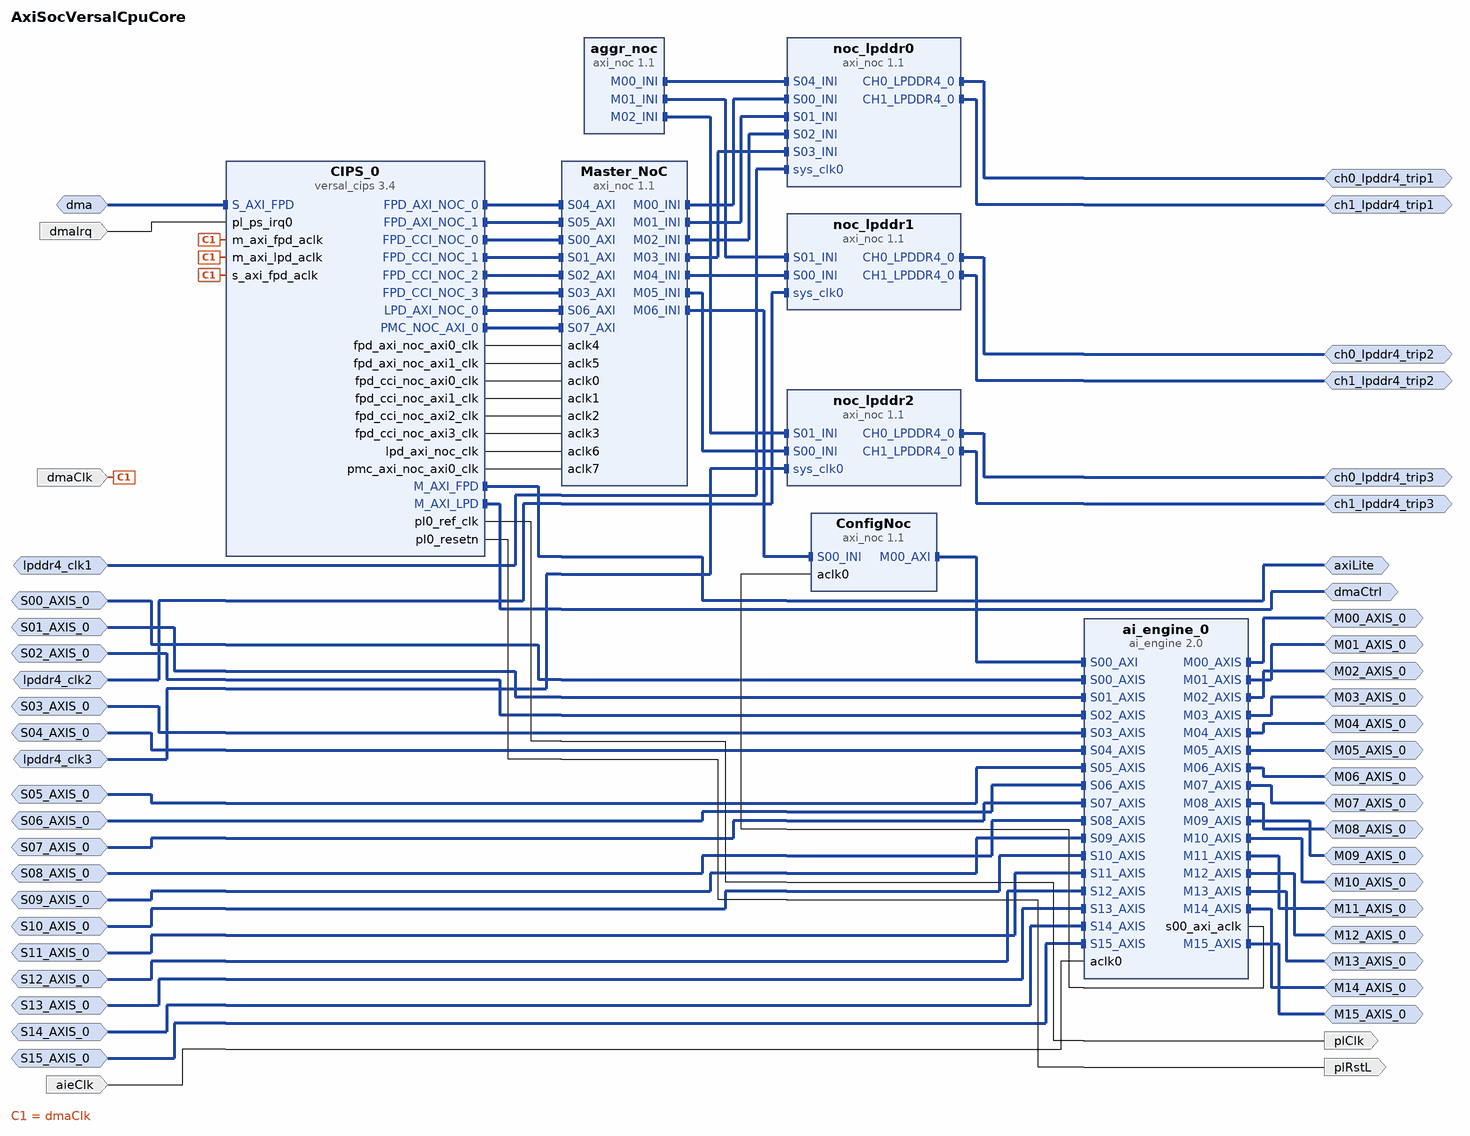
[diagram p0: block diagram of the top level]
# Vivado block design AxiSocVersalCpuCore, xcve2802-vsvh1760-2MP-e-S, Vivado 2025.1
create_bd_design AxiSocVersalCpuCore

create_bd_intf_port -mode Master -vlnv xilinx.com:interface:lpddr4_rtl:1.0 ch0_lpddr4_trip1
create_bd_intf_port -mode Master -vlnv xilinx.com:interface:lpddr4_rtl:1.0 ch1_lpddr4_trip1
create_bd_intf_port -mode Slave -vlnv xilinx.com:interface:diff_clock_rtl:1.0 lpddr4_clk1
set_property -dict {CONFIG.FREQ_HZ 200000000} [get_bd_intf_ports lpddr4_clk1]
create_bd_intf_port -mode Master -vlnv xilinx.com:interface:lpddr4_rtl:1.0 ch0_lpddr4_trip2
create_bd_intf_port -mode Master -vlnv xilinx.com:interface:lpddr4_rtl:1.0 ch1_lpddr4_trip2
create_bd_intf_port -mode Slave -vlnv xilinx.com:interface:diff_clock_rtl:1.0 lpddr4_clk2
set_property -dict {CONFIG.FREQ_HZ 200000000} [get_bd_intf_ports lpddr4_clk2]
create_bd_intf_port -mode Master -vlnv xilinx.com:interface:lpddr4_rtl:1.0 ch0_lpddr4_trip3
create_bd_intf_port -mode Master -vlnv xilinx.com:interface:lpddr4_rtl:1.0 ch1_lpddr4_trip3
create_bd_intf_port -mode Slave -vlnv xilinx.com:interface:diff_clock_rtl:1.0 lpddr4_clk3
set_property -dict {CONFIG.FREQ_HZ 200000000} [get_bd_intf_ports lpddr4_clk3]
create_bd_intf_port -mode Slave -vlnv xilinx.com:interface:aximm_rtl:1.0 dma
set_property -dict [list \
  CONFIG.ADDR_WIDTH 49 \
  CONFIG.ARUSER_WIDTH 10 \
  CONFIG.AWUSER_WIDTH 10 \
  CONFIG.BUSER_WIDTH 0 \
  CONFIG.DATA_WIDTH 128 \
  CONFIG.FREQ_HZ 250000000 \
  CONFIG.HAS_BRESP 1 \
  CONFIG.HAS_BURST 1 \
  CONFIG.HAS_CACHE 1 \
  CONFIG.HAS_LOCK 1 \
  CONFIG.HAS_PROT 1 \
  CONFIG.HAS_QOS 1 \
  CONFIG.HAS_REGION 0 \
  CONFIG.HAS_RRESP 1 \
  CONFIG.HAS_WSTRB 1 \
  CONFIG.ID_WIDTH 6 \
  CONFIG.MAX_BURST_LENGTH 256 \
  CONFIG.NUM_READ_OUTSTANDING 2 \
  CONFIG.NUM_READ_THREADS 1 \
  CONFIG.NUM_WRITE_OUTSTANDING 2 \
  CONFIG.NUM_WRITE_THREADS 1 \
  CONFIG.PROTOCOL AXI4 \
  CONFIG.READ_WRITE_MODE READ_WRITE \
  CONFIG.RUSER_BITS_PER_BYTE 0 \
  CONFIG.RUSER_WIDTH 0 \
  CONFIG.SUPPORTS_NARROW_BURST 1 \
  CONFIG.WUSER_BITS_PER_BYTE 0 \
  CONFIG.WUSER_WIDTH 0 \
] [get_bd_intf_ports dma]
create_bd_intf_port -mode Master -vlnv xilinx.com:interface:aximm_rtl:1.0 dmaCtrl
set_property -dict [list \
  CONFIG.ADDR_WIDTH 44 \
  CONFIG.DATA_WIDTH 32 \
  CONFIG.FREQ_HZ 250000000 \
  CONFIG.HAS_REGION 0 \
  CONFIG.NUM_READ_OUTSTANDING 2 \
  CONFIG.NUM_WRITE_OUTSTANDING 2 \
  CONFIG.PROTOCOL AXI4 \
] [get_bd_intf_ports dmaCtrl]
create_bd_intf_port -mode Master -vlnv xilinx.com:interface:aximm_rtl:1.0 axiLite
set_property -dict [list \
  CONFIG.ADDR_WIDTH 44 \
  CONFIG.DATA_WIDTH 32 \
  CONFIG.FREQ_HZ 250000000 \
  CONFIG.HAS_REGION 0 \
  CONFIG.NUM_READ_OUTSTANDING 2 \
  CONFIG.NUM_WRITE_OUTSTANDING 2 \
  CONFIG.PROTOCOL AXI4 \
] [get_bd_intf_ports axiLite]
create_bd_intf_port -mode Slave -vlnv xilinx.com:interface:axis_rtl:1.0 S00_AXIS_0
set_property -dict [list \
  CONFIG.FREQ_HZ 250000000 \
  CONFIG.HAS_TKEEP 1 \
  CONFIG.HAS_TLAST 1 \
  CONFIG.HAS_TREADY 1 \
  CONFIG.HAS_TSTRB 0 \
  CONFIG.LAYERED_METADATA undef \
  CONFIG.TDATA_NUM_BYTES 16 \
  CONFIG.TDEST_WIDTH 0 \
  CONFIG.TID_WIDTH 0 \
  CONFIG.TUSER_WIDTH 0 \
] [get_bd_intf_ports S00_AXIS_0]
create_bd_intf_port -mode Slave -vlnv xilinx.com:interface:axis_rtl:1.0 S01_AXIS_0
set_property -dict [list \
  CONFIG.FREQ_HZ 250000000 \
  CONFIG.HAS_TKEEP 1 \
  CONFIG.HAS_TLAST 1 \
  CONFIG.HAS_TREADY 1 \
  CONFIG.HAS_TSTRB 0 \
  CONFIG.LAYERED_METADATA undef \
  CONFIG.TDATA_NUM_BYTES 16 \
  CONFIG.TDEST_WIDTH 0 \
  CONFIG.TID_WIDTH 0 \
  CONFIG.TUSER_WIDTH 0 \
] [get_bd_intf_ports S01_AXIS_0]
create_bd_intf_port -mode Slave -vlnv xilinx.com:interface:axis_rtl:1.0 S02_AXIS_0
set_property -dict [list \
  CONFIG.FREQ_HZ 250000000 \
  CONFIG.HAS_TKEEP 1 \
  CONFIG.HAS_TLAST 1 \
  CONFIG.HAS_TREADY 1 \
  CONFIG.HAS_TSTRB 0 \
  CONFIG.LAYERED_METADATA undef \
  CONFIG.TDATA_NUM_BYTES 16 \
  CONFIG.TDEST_WIDTH 0 \
  CONFIG.TID_WIDTH 0 \
  CONFIG.TUSER_WIDTH 0 \
] [get_bd_intf_ports S02_AXIS_0]
create_bd_intf_port -mode Slave -vlnv xilinx.com:interface:axis_rtl:1.0 S03_AXIS_0
set_property -dict [list \
  CONFIG.FREQ_HZ 250000000 \
  CONFIG.HAS_TKEEP 1 \
  CONFIG.HAS_TLAST 1 \
  CONFIG.HAS_TREADY 1 \
  CONFIG.HAS_TSTRB 0 \
  CONFIG.LAYERED_METADATA undef \
  CONFIG.TDATA_NUM_BYTES 16 \
  CONFIG.TDEST_WIDTH 0 \
  CONFIG.TID_WIDTH 0 \
  CONFIG.TUSER_WIDTH 0 \
] [get_bd_intf_ports S03_AXIS_0]
create_bd_intf_port -mode Slave -vlnv xilinx.com:interface:axis_rtl:1.0 S04_AXIS_0
set_property -dict [list \
  CONFIG.FREQ_HZ 250000000 \
  CONFIG.HAS_TKEEP 1 \
  CONFIG.HAS_TLAST 1 \
  CONFIG.HAS_TREADY 1 \
  CONFIG.HAS_TSTRB 0 \
  CONFIG.LAYERED_METADATA undef \
  CONFIG.TDATA_NUM_BYTES 16 \
  CONFIG.TDEST_WIDTH 0 \
  CONFIG.TID_WIDTH 0 \
  CONFIG.TUSER_WIDTH 0 \
] [get_bd_intf_ports S04_AXIS_0]
create_bd_intf_port -mode Slave -vlnv xilinx.com:interface:axis_rtl:1.0 S05_AXIS_0
set_property -dict [list \
  CONFIG.FREQ_HZ 250000000 \
  CONFIG.HAS_TKEEP 1 \
  CONFIG.HAS_TLAST 1 \
  CONFIG.HAS_TREADY 1 \
  CONFIG.HAS_TSTRB 0 \
  CONFIG.LAYERED_METADATA undef \
  CONFIG.TDATA_NUM_BYTES 16 \
  CONFIG.TDEST_WIDTH 0 \
  CONFIG.TID_WIDTH 0 \
  CONFIG.TUSER_WIDTH 0 \
] [get_bd_intf_ports S05_AXIS_0]
create_bd_intf_port -mode Slave -vlnv xilinx.com:interface:axis_rtl:1.0 S06_AXIS_0
set_property -dict [list \
  CONFIG.FREQ_HZ 250000000 \
  CONFIG.HAS_TKEEP 1 \
  CONFIG.HAS_TLAST 1 \
  CONFIG.HAS_TREADY 1 \
  CONFIG.HAS_TSTRB 0 \
  CONFIG.LAYERED_METADATA undef \
  CONFIG.TDATA_NUM_BYTES 16 \
  CONFIG.TDEST_WIDTH 0 \
  CONFIG.TID_WIDTH 0 \
  CONFIG.TUSER_WIDTH 0 \
] [get_bd_intf_ports S06_AXIS_0]
create_bd_intf_port -mode Slave -vlnv xilinx.com:interface:axis_rtl:1.0 S07_AXIS_0
set_property -dict [list \
  CONFIG.FREQ_HZ 250000000 \
  CONFIG.HAS_TKEEP 1 \
  CONFIG.HAS_TLAST 1 \
  CONFIG.HAS_TREADY 1 \
  CONFIG.HAS_TSTRB 0 \
  CONFIG.LAYERED_METADATA undef \
  CONFIG.TDATA_NUM_BYTES 16 \
  CONFIG.TDEST_WIDTH 0 \
  CONFIG.TID_WIDTH 0 \
  CONFIG.TUSER_WIDTH 0 \
] [get_bd_intf_ports S07_AXIS_0]
create_bd_intf_port -mode Slave -vlnv xilinx.com:interface:axis_rtl:1.0 S08_AXIS_0
set_property -dict [list \
  CONFIG.FREQ_HZ 250000000 \
  CONFIG.HAS_TKEEP 1 \
  CONFIG.HAS_TLAST 1 \
  CONFIG.HAS_TREADY 1 \
  CONFIG.HAS_TSTRB 0 \
  CONFIG.LAYERED_METADATA undef \
  CONFIG.TDATA_NUM_BYTES 16 \
  CONFIG.TDEST_WIDTH 0 \
  CONFIG.TID_WIDTH 0 \
  CONFIG.TUSER_WIDTH 0 \
] [get_bd_intf_ports S08_AXIS_0]
create_bd_intf_port -mode Slave -vlnv xilinx.com:interface:axis_rtl:1.0 S09_AXIS_0
set_property -dict [list \
  CONFIG.FREQ_HZ 250000000 \
  CONFIG.HAS_TKEEP 1 \
  CONFIG.HAS_TLAST 1 \
  CONFIG.HAS_TREADY 1 \
  CONFIG.HAS_TSTRB 0 \
  CONFIG.LAYERED_METADATA undef \
  CONFIG.TDATA_NUM_BYTES 16 \
  CONFIG.TDEST_WIDTH 0 \
  CONFIG.TID_WIDTH 0 \
  CONFIG.TUSER_WIDTH 0 \
] [get_bd_intf_ports S09_AXIS_0]
create_bd_intf_port -mode Slave -vlnv xilinx.com:interface:axis_rtl:1.0 S10_AXIS_0
set_property -dict [list \
  CONFIG.FREQ_HZ 250000000 \
  CONFIG.HAS_TKEEP 1 \
  CONFIG.HAS_TLAST 1 \
  CONFIG.HAS_TREADY 1 \
  CONFIG.HAS_TSTRB 0 \
  CONFIG.LAYERED_METADATA undef \
  CONFIG.TDATA_NUM_BYTES 16 \
  CONFIG.TDEST_WIDTH 0 \
  CONFIG.TID_WIDTH 0 \
  CONFIG.TUSER_WIDTH 0 \
] [get_bd_intf_ports S10_AXIS_0]
create_bd_intf_port -mode Slave -vlnv xilinx.com:interface:axis_rtl:1.0 S11_AXIS_0
set_property -dict [list \
  CONFIG.FREQ_HZ 250000000 \
  CONFIG.HAS_TKEEP 1 \
  CONFIG.HAS_TLAST 1 \
  CONFIG.HAS_TREADY 1 \
  CONFIG.HAS_TSTRB 0 \
  CONFIG.LAYERED_METADATA undef \
  CONFIG.TDATA_NUM_BYTES 16 \
  CONFIG.TDEST_WIDTH 0 \
  CONFIG.TID_WIDTH 0 \
  CONFIG.TUSER_WIDTH 0 \
] [get_bd_intf_ports S11_AXIS_0]
create_bd_intf_port -mode Slave -vlnv xilinx.com:interface:axis_rtl:1.0 S12_AXIS_0
set_property -dict [list \
  CONFIG.FREQ_HZ 250000000 \
  CONFIG.HAS_TKEEP 1 \
  CONFIG.HAS_TLAST 1 \
  CONFIG.HAS_TREADY 1 \
  CONFIG.HAS_TSTRB 0 \
  CONFIG.LAYERED_METADATA undef \
  CONFIG.TDATA_NUM_BYTES 16 \
  CONFIG.TDEST_WIDTH 0 \
  CONFIG.TID_WIDTH 0 \
  CONFIG.TUSER_WIDTH 0 \
] [get_bd_intf_ports S12_AXIS_0]
create_bd_intf_port -mode Slave -vlnv xilinx.com:interface:axis_rtl:1.0 S13_AXIS_0
set_property -dict [list \
  CONFIG.FREQ_HZ 250000000 \
  CONFIG.HAS_TKEEP 1 \
  CONFIG.HAS_TLAST 1 \
  CONFIG.HAS_TREADY 1 \
  CONFIG.HAS_TSTRB 0 \
  CONFIG.LAYERED_METADATA undef \
  CONFIG.TDATA_NUM_BYTES 16 \
  CONFIG.TDEST_WIDTH 0 \
  CONFIG.TID_WIDTH 0 \
  CONFIG.TUSER_WIDTH 0 \
] [get_bd_intf_ports S13_AXIS_0]
create_bd_intf_port -mode Slave -vlnv xilinx.com:interface:axis_rtl:1.0 S14_AXIS_0
set_property -dict [list \
  CONFIG.FREQ_HZ 250000000 \
  CONFIG.HAS_TKEEP 1 \
  CONFIG.HAS_TLAST 1 \
  CONFIG.HAS_TREADY 1 \
  CONFIG.HAS_TSTRB 0 \
  CONFIG.LAYERED_METADATA undef \
  CONFIG.TDATA_NUM_BYTES 16 \
  CONFIG.TDEST_WIDTH 0 \
  CONFIG.TID_WIDTH 0 \
  CONFIG.TUSER_WIDTH 0 \
] [get_bd_intf_ports S14_AXIS_0]
create_bd_intf_port -mode Slave -vlnv xilinx.com:interface:axis_rtl:1.0 S15_AXIS_0
set_property -dict [list \
  CONFIG.FREQ_HZ 250000000 \
  CONFIG.HAS_TKEEP 1 \
  CONFIG.HAS_TLAST 1 \
  CONFIG.HAS_TREADY 1 \
  CONFIG.HAS_TSTRB 0 \
  CONFIG.LAYERED_METADATA undef \
  CONFIG.TDATA_NUM_BYTES 16 \
  CONFIG.TDEST_WIDTH 0 \
  CONFIG.TID_WIDTH 0 \
  CONFIG.TUSER_WIDTH 0 \
] [get_bd_intf_ports S15_AXIS_0]
create_bd_intf_port -mode Master -vlnv xilinx.com:interface:axis_rtl:1.0 M00_AXIS_0
set_property -dict {CONFIG.FREQ_HZ 250000000} [get_bd_intf_ports M00_AXIS_0]
create_bd_intf_port -mode Master -vlnv xilinx.com:interface:axis_rtl:1.0 M01_AXIS_0
set_property -dict {CONFIG.FREQ_HZ 250000000} [get_bd_intf_ports M01_AXIS_0]
create_bd_intf_port -mode Master -vlnv xilinx.com:interface:axis_rtl:1.0 M02_AXIS_0
set_property -dict {CONFIG.FREQ_HZ 250000000} [get_bd_intf_ports M02_AXIS_0]
create_bd_intf_port -mode Master -vlnv xilinx.com:interface:axis_rtl:1.0 M03_AXIS_0
set_property -dict {CONFIG.FREQ_HZ 250000000} [get_bd_intf_ports M03_AXIS_0]
create_bd_intf_port -mode Master -vlnv xilinx.com:interface:axis_rtl:1.0 M04_AXIS_0
set_property -dict {CONFIG.FREQ_HZ 250000000} [get_bd_intf_ports M04_AXIS_0]
create_bd_intf_port -mode Master -vlnv xilinx.com:interface:axis_rtl:1.0 M05_AXIS_0
set_property -dict {CONFIG.FREQ_HZ 250000000} [get_bd_intf_ports M05_AXIS_0]
create_bd_intf_port -mode Master -vlnv xilinx.com:interface:axis_rtl:1.0 M06_AXIS_0
set_property -dict {CONFIG.FREQ_HZ 250000000} [get_bd_intf_ports M06_AXIS_0]
create_bd_intf_port -mode Master -vlnv xilinx.com:interface:axis_rtl:1.0 M07_AXIS_0
set_property -dict {CONFIG.FREQ_HZ 250000000} [get_bd_intf_ports M07_AXIS_0]
create_bd_intf_port -mode Master -vlnv xilinx.com:interface:axis_rtl:1.0 M08_AXIS_0
set_property -dict {CONFIG.FREQ_HZ 250000000} [get_bd_intf_ports M08_AXIS_0]
create_bd_intf_port -mode Master -vlnv xilinx.com:interface:axis_rtl:1.0 M09_AXIS_0
set_property -dict {CONFIG.FREQ_HZ 250000000} [get_bd_intf_ports M09_AXIS_0]
create_bd_intf_port -mode Master -vlnv xilinx.com:interface:axis_rtl:1.0 M10_AXIS_0
set_property -dict {CONFIG.FREQ_HZ 250000000} [get_bd_intf_ports M10_AXIS_0]
create_bd_intf_port -mode Master -vlnv xilinx.com:interface:axis_rtl:1.0 M11_AXIS_0
set_property -dict {CONFIG.FREQ_HZ 250000000} [get_bd_intf_ports M11_AXIS_0]
create_bd_intf_port -mode Master -vlnv xilinx.com:interface:axis_rtl:1.0 M12_AXIS_0
set_property -dict {CONFIG.FREQ_HZ 250000000} [get_bd_intf_ports M12_AXIS_0]
create_bd_intf_port -mode Master -vlnv xilinx.com:interface:axis_rtl:1.0 M13_AXIS_0
set_property -dict {CONFIG.FREQ_HZ 250000000} [get_bd_intf_ports M13_AXIS_0]
create_bd_intf_port -mode Master -vlnv xilinx.com:interface:axis_rtl:1.0 M14_AXIS_0
set_property -dict {CONFIG.FREQ_HZ 250000000} [get_bd_intf_ports M14_AXIS_0]
create_bd_intf_port -mode Master -vlnv xilinx.com:interface:axis_rtl:1.0 M15_AXIS_0
set_property -dict {CONFIG.FREQ_HZ 250000000} [get_bd_intf_ports M15_AXIS_0]
create_bd_port -dir I -type intr dmaIrq
create_bd_port -dir I -type clk dmaClk
set_property -dict {CONFIG.ASSOCIATED_BUSIF dma:dmaCtrl:axiLite CONFIG.FREQ_HZ 250000000} [get_bd_ports dmaClk]
create_bd_port -dir O -type clk plClk
create_bd_port -dir O -type rst plRstL
create_bd_port -dir I -type clk aieClk
set_property -dict [list \
  CONFIG.ASSOCIATED_BUSIF M00_AXIS_0:M15_AXIS_0:M14_AXIS_0:M13_AXIS_0:M12_AXIS_0:M11_AXIS_0:M10_AXIS_0:M09_AXIS_0:M08_AXIS_0:M07_AXIS_0:M06_AXIS_0:M05_AXIS_0:M04_AXIS_0:M03_AXIS_0:M02_AXIS_0:M01_AXIS_0:S00_AXIS_0:S01_AXIS_0:S02_AXIS_0:S03_AXIS_0:S04_AXIS_0:S05_AXIS_0:S06_AXIS_0:S07_AXIS_0:S08_AXIS_0:S09_AXIS_0:S10_AXIS_0:S11_AXIS_0:S12_AXIS_0:S13_AXIS_0:S14_AXIS_0:S15_AXIS_0 \
  CONFIG.FREQ_HZ 250000000 \
] [get_bd_ports aieClk]

create_bd_cell -type ip -vlnv xilinx.com:ip:versal_cips:3.4 CIPS_0
set_property -dict [list \
  CONFIG.CLOCK_MODE Custom \
  CONFIG.DDR_MEMORY_MODE Custom \
  CONFIG.PS_BOARD_INTERFACE ps_pmc_fixed_io \
  CONFIG.PS_PL_CONNECTIVITY_MODE Custom \
  CONFIG.PS_PMC_CONFIG {['CLOCK_MODE Custom', 'DDR_MEMORY_MODE Custom', 'DESIGN_MODE 1', 'DEVICE_INTEGRITY_MODE {Sysmon temperature voltage and external IO monitoring}', 'PMC_CRP_PL0_REF_CTRL_FREQMHZ 250', 'PMC_GPIO0_MIO_PERIPHERAL {{ENABLE 1} {IO {PMC_MIO 0 .. 25}}}', 'PMC_GPIO1_MIO_PERIPHERAL {{ENABLE 1} {IO {PMC_MIO 26 .. 51}}}', 'PMC_MIO12 {{AUX_IO 0} {DIRECTION out} {DRIVE_STRENGTH 8mA} {OUTPUT_DATA default} {PULL pullup} {SCHMITT 0} {SLEW slow} {USAGE GPIO}}', 'PMC_MIO37 {{AUX_IO 0} {DIRECTION out} {DRIVE_STRENGTH 8mA} {OUTPUT_DATA high} {PULL pullup} {SCHMITT 0} {SLEW slow} {USAGE GPIO}}', 'PMC_MIO38 {{AUX_IO 0} {DIRECTION out} {DRIVE_STRENGTH 8mA} {OUTPUT_DATA high} {PULL pullup} {SCHMITT 0} {SLEW slow} {USAGE GPIO}}', 'PMC_OSPI_PERIPHERAL {{ENABLE 1} {IO {PMC_MIO 0 .. 11}} {MODE Single}}', 'PMC_REF_CLK_FREQMHZ 33.3333', 'PMC_SD1 {{CD_ENABLE 1} {CD_IO {PMC_MIO 28}} {POW_ENABLE 1} {POW_IO {PMC_MIO 51}} {RESET_ENABLE 0} {RESET_IO {PMC_MIO 12}} {WP_ENABLE 0} {WP_IO {PMC_MIO 1}}}', 'PMC_SD1_PERIPHERAL {{CLK_100_SDR_OTAP_DLY 0x3} {CLK_200_SDR_OTAP_DLY 0x2} {CLK_50_DDR_ITAP_DLY 0x36} {CLK_50_DDR_OTAP_DLY 0x3} {CLK_50_SDR_ITAP_DLY 0x2C} {CLK_50_SDR_OTAP_DLY 0x4} {ENABLE 1} {IO {PMC_MIO 26 .. 36}}}', 'PMC_SD1_SLOT_TYPE {SD 3.0}', 'PMC_USE_PMC_NOC_AXI0 1', 'PS_BOARD_INTERFACE ps_pmc_fixed_io', 'PS_CAN0_PERIPHERAL {{ENABLE 1} {IO {PS_MIO 14 .. 15}}}', 'PS_CAN1_PERIPHERAL {{ENABLE 1} {IO {PS_MIO 16 .. 17}}}', 'PS_CRL_CAN0_REF_CTRL_FREQMHZ 160', 'PS_CRL_CAN1_REF_CTRL_FREQMHZ 160', 'PS_ENET0_MDIO {{ENABLE 1} {IO {PS_MIO 24 .. 25}}}', 'PS_ENET0_PERIPHERAL {{ENABLE 1} {IO {PS_MIO 0 .. 11}}}', 'PS_GEN_IPI0_ENABLE 1', 'PS_GEN_IPI0_MASTER A72', 'PS_GEN_IPI1_ENABLE 1', 'PS_GEN_IPI1_MASTER R5_0', 'PS_GEN_IPI2_ENABLE 1', 'PS_GEN_IPI2_MASTER R5_1', 'PS_GEN_IPI3_ENABLE 1', 'PS_GEN_IPI3_MASTER A72', 'PS_GEN_IPI4_ENABLE 1', 'PS_GEN_IPI4_MASTER A72', 'PS_GEN_IPI5_ENABLE 1', 'PS_GEN_IPI5_MASTER A72', 'PS_GEN_IPI6_ENABLE 1', 'PS_GEN_IPI6_MASTER A72', 'PS_I2C0_PERIPHERAL {{ENABLE 1} {IO {PMC_MIO 46 .. 47}}}', 'PS_I2C1_PERIPHERAL {{ENABLE 1} {IO {PMC_MIO 44 .. 45}}}', 'PS_I2CSYSMON_PERIPHERAL {{ENABLE 0} {IO {PMC_MIO 39 .. 40}}}', 'PS_IRQ_USAGE {{CH0 1} {CH1 0} {CH10 0} {CH11 0} {CH12 0} {CH13 0} {CH14 0} {CH15 0} {CH2 0} {CH3 0} {CH4 0} {CH5 0} {CH6 0} {CH7 0} {CH8 0} {CH9 0}}', 'PS_MIO7 {{AUX_IO 0} {DIRECTION in} {DRIVE_STRENGTH 8mA} {OUTPUT_DATA default} {PULL disable} {SCHMITT 0} {SLEW slow} {USAGE Reserved}}', 'PS_MIO9 {{AUX_IO 0} {DIRECTION in} {DRIVE_STRENGTH 8mA} {OUTPUT_DATA default} {PULL disable} {SCHMITT 0} {SLEW slow} {USAGE Reserved}}', 'PS_M_AXI_FPD_DATA_WIDTH 32', 'PS_M_AXI_LPD_DATA_WIDTH 32', 'PS_NUM_FABRIC_RESETS 1', 'PS_PCIE_EP_RESET1_IO {PS_MIO 18}', 'PS_PCIE_EP_RESET2_IO {PS_MIO 19}', 'PS_PCIE_RESET {ENABLE 1}', 'PS_PL_CONNECTIVITY_MODE Custom', 'PS_TTC0_PERIPHERAL_ENABLE 1', 'PS_UART0_PERIPHERAL {{ENABLE 1} {IO {PMC_MIO 42 .. 43}}}', 'PS_USB3_PERIPHERAL {{ENABLE 1} {IO {PMC_MIO 13 .. 25}}}', 'PS_USE_FPD_AXI_NOC0 1', 'PS_USE_FPD_AXI_NOC1 1', 'PS_USE_FPD_CCI_NOC 1', 'PS_USE_M_AXI_FPD 1', 'PS_USE_M_AXI_LPD 1', 'PS_USE_NOC_LPD_AXI0 1', 'PS_USE_PMCPL_CLK0 1', 'PS_USE_S_AXI_FPD 1', 'SMON_ALARMS Set_Alarms_On', 'SMON_ENABLE_TEMP_AVERAGING 0', 'SMON_INTERFACE_TO_USE I2C', 'SMON_PMBUS_ADDRESS 0x18', 'SMON_TEMP_AVERAGING_SAMPLES 0']} \
] [get_bd_cells CIPS_0]
create_bd_cell -type ip -vlnv xilinx.com:ip:axi_noc:1.1 Master_NoC
set_property -dict {CONFIG.NUM_CLKS 8 CONFIG.NUM_MI 0 CONFIG.NUM_NMI 7 CONFIG.NUM_SI 8} [get_bd_cells Master_NoC]
create_bd_cell -type ip -vlnv xilinx.com:ip:axi_noc:1.1 noc_lpddr0
set_property -dict [list \
  CONFIG.CH0_LPDDR4_0_BOARD_INTERFACE ch0_lpddr4_trip1 \
  CONFIG.CH1_LPDDR4_0_BOARD_INTERFACE ch1_lpddr4_trip1 \
  CONFIG.MC_CHANNEL_INTERLEAVING true \
  CONFIG.MC_CHAN_REGION1 DDR_LOW1 \
  CONFIG.MC_CH_INTERLEAVING_SIZE 4K_Bytes \
  CONFIG.NUM_MCP 4 \
  CONFIG.NUM_MI 0 \
  CONFIG.NUM_NSI 5 \
  CONFIG.NUM_SI 0 \
  CONFIG.sys_clk0_BOARD_INTERFACE lpddr4_clk1 \
] [get_bd_cells noc_lpddr0]
create_bd_cell -type ip -vlnv xilinx.com:ip:ai_engine:2.0 ai_engine_0
set_property -dict [list \
  CONFIG.CLK_NAMES aclk0 \
  CONFIG.NAME_MI_AXIS M00_AXIS,M01_AXIS,M02_AXIS,M03_AXIS,M04_AXIS,M05_AXIS,M06_AXIS,M07_AXIS,M08_AXIS,M09_AXIS,M10_AXIS,M11_AXIS,M12_AXIS,M13_AXIS,M14_AXIS,M15_AXIS, \
  CONFIG.NAME_SI_AXIS S00_AXIS,S01_AXIS,S02_AXIS,S03_AXIS,S04_AXIS,S05_AXIS,S06_AXIS,S07_AXIS,S08_AXIS,S09_AXIS,S10_AXIS,S11_AXIS,S12_AXIS,S13_AXIS,S14_AXIS,S15_AXIS, \
  CONFIG.NUM_CLKS 1 \
  CONFIG.NUM_MI_AXIS 16 \
  CONFIG.NUM_SI_AXIS 16 \
] [get_bd_cells ai_engine_0]
create_bd_cell -type ip -vlnv xilinx.com:ip:axi_noc:1.1 ConfigNoc
set_property -dict {CONFIG.NUM_NSI 1 CONFIG.NUM_SI 0} [get_bd_cells ConfigNoc]
create_bd_cell -type ip -vlnv xilinx.com:ip:axi_noc:1.1 noc_lpddr1
set_property -dict [list \
  CONFIG.CH0_LPDDR4_0_BOARD_INTERFACE ch0_lpddr4_trip2 \
  CONFIG.CH1_LPDDR4_0_BOARD_INTERFACE ch1_lpddr4_trip2 \
  CONFIG.MC_CHAN_REGION0 DDR_CH1 \
  CONFIG.NUM_MCP 2 \
  CONFIG.NUM_MI 0 \
  CONFIG.NUM_NSI 2 \
  CONFIG.NUM_SI 0 \
  CONFIG.sys_clk0_BOARD_INTERFACE lpddr4_clk2 \
] [get_bd_cells noc_lpddr1]
create_bd_cell -type ip -vlnv xilinx.com:ip:axi_noc:1.1 noc_lpddr2
set_property -dict [list \
  CONFIG.CH0_LPDDR4_0_BOARD_INTERFACE ch0_lpddr4_trip3 \
  CONFIG.CH1_LPDDR4_0_BOARD_INTERFACE ch1_lpddr4_trip3 \
  CONFIG.MC_CHAN_REGION0 DDR_CH2 \
  CONFIG.NUM_MCP 2 \
  CONFIG.NUM_MI 0 \
  CONFIG.NUM_NSI 2 \
  CONFIG.NUM_SI 0 \
  CONFIG.sys_clk0_BOARD_INTERFACE lpddr4_clk3 \
] [get_bd_cells noc_lpddr2]
create_bd_cell -type ip -vlnv xilinx.com:ip:axi_noc:1.1 aggr_noc
set_property -dict {CONFIG.NUM_MI 0 CONFIG.NUM_NMI 3 CONFIG.NUM_SI 0} [get_bd_cells aggr_noc]

# ---- connections ----

connect_bd_intf_net [get_bd_intf_pins CIPS_0/FPD_AXI_NOC_0] [get_bd_intf_pins Master_NoC/S04_AXI]
connect_bd_intf_net [get_bd_intf_pins CIPS_0/FPD_AXI_NOC_1] [get_bd_intf_pins Master_NoC/S05_AXI]
connect_bd_intf_net [get_bd_intf_pins CIPS_0/FPD_CCI_NOC_0] [get_bd_intf_pins Master_NoC/S00_AXI]
connect_bd_intf_net [get_bd_intf_pins CIPS_0/FPD_CCI_NOC_1] [get_bd_intf_pins Master_NoC/S01_AXI]
connect_bd_intf_net [get_bd_intf_pins CIPS_0/FPD_CCI_NOC_2] [get_bd_intf_pins Master_NoC/S02_AXI]
connect_bd_intf_net [get_bd_intf_pins CIPS_0/FPD_CCI_NOC_3] [get_bd_intf_pins Master_NoC/S03_AXI]
connect_bd_intf_net [get_bd_intf_pins CIPS_0/LPD_AXI_NOC_0] [get_bd_intf_pins Master_NoC/S06_AXI]
connect_bd_intf_net [get_bd_intf_ports axiLite] [get_bd_intf_pins CIPS_0/M_AXI_FPD]
connect_bd_intf_net [get_bd_intf_ports dmaCtrl] [get_bd_intf_pins CIPS_0/M_AXI_LPD]
connect_bd_intf_net [get_bd_intf_pins CIPS_0/PMC_NOC_AXI_0] [get_bd_intf_pins Master_NoC/S07_AXI]
connect_bd_intf_net [get_bd_intf_pins ConfigNoc/M00_AXI] [get_bd_intf_pins ai_engine_0/S00_AXI]
connect_bd_intf_net [get_bd_intf_pins Master_NoC/M00_INI] [get_bd_intf_pins noc_lpddr0/S00_INI]
connect_bd_intf_net [get_bd_intf_pins Master_NoC/M01_INI] [get_bd_intf_pins noc_lpddr0/S01_INI]
connect_bd_intf_net [get_bd_intf_pins Master_NoC/M02_INI] [get_bd_intf_pins noc_lpddr0/S02_INI]
connect_bd_intf_net [get_bd_intf_pins Master_NoC/M03_INI] [get_bd_intf_pins noc_lpddr0/S03_INI]
connect_bd_intf_net [get_bd_intf_pins Master_NoC/M04_INI] [get_bd_intf_pins noc_lpddr1/S00_INI]
connect_bd_intf_net [get_bd_intf_pins Master_NoC/M05_INI] [get_bd_intf_pins noc_lpddr2/S00_INI]
connect_bd_intf_net [get_bd_intf_pins Master_NoC/M06_INI] [get_bd_intf_pins ConfigNoc/S00_INI]
connect_bd_intf_net -intf_net S00_AXIS_0_1 [get_bd_intf_ports S00_AXIS_0] [get_bd_intf_pins ai_engine_0/S00_AXIS]
connect_bd_intf_net -intf_net S01_AXIS_0_1 [get_bd_intf_ports S01_AXIS_0] [get_bd_intf_pins ai_engine_0/S01_AXIS]
connect_bd_intf_net -intf_net S02_AXIS_0_1 [get_bd_intf_ports S02_AXIS_0] [get_bd_intf_pins ai_engine_0/S02_AXIS]
connect_bd_intf_net -intf_net S03_AXIS_0_1 [get_bd_intf_ports S03_AXIS_0] [get_bd_intf_pins ai_engine_0/S03_AXIS]
connect_bd_intf_net -intf_net S04_AXIS_0_1 [get_bd_intf_ports S04_AXIS_0] [get_bd_intf_pins ai_engine_0/S04_AXIS]
connect_bd_intf_net -intf_net S05_AXIS_0_1 [get_bd_intf_ports S05_AXIS_0] [get_bd_intf_pins ai_engine_0/S05_AXIS]
connect_bd_intf_net -intf_net S06_AXIS_0_1 [get_bd_intf_ports S06_AXIS_0] [get_bd_intf_pins ai_engine_0/S06_AXIS]
connect_bd_intf_net -intf_net S07_AXIS_0_1 [get_bd_intf_ports S07_AXIS_0] [get_bd_intf_pins ai_engine_0/S07_AXIS]
connect_bd_intf_net -intf_net S08_AXIS_0_1 [get_bd_intf_ports S08_AXIS_0] [get_bd_intf_pins ai_engine_0/S08_AXIS]
connect_bd_intf_net -intf_net S09_AXIS_0_1 [get_bd_intf_ports S09_AXIS_0] [get_bd_intf_pins ai_engine_0/S09_AXIS]
connect_bd_intf_net -intf_net S10_AXIS_0_1 [get_bd_intf_ports S10_AXIS_0] [get_bd_intf_pins ai_engine_0/S10_AXIS]
connect_bd_intf_net -intf_net S11_AXIS_0_1 [get_bd_intf_ports S11_AXIS_0] [get_bd_intf_pins ai_engine_0/S11_AXIS]
connect_bd_intf_net -intf_net S12_AXIS_0_1 [get_bd_intf_ports S12_AXIS_0] [get_bd_intf_pins ai_engine_0/S12_AXIS]
connect_bd_intf_net -intf_net S13_AXIS_0_1 [get_bd_intf_ports S13_AXIS_0] [get_bd_intf_pins ai_engine_0/S13_AXIS]
connect_bd_intf_net -intf_net S14_AXIS_0_1 [get_bd_intf_ports S14_AXIS_0] [get_bd_intf_pins ai_engine_0/S14_AXIS]
connect_bd_intf_net -intf_net S15_AXIS_0_1 [get_bd_intf_ports S15_AXIS_0] [get_bd_intf_pins ai_engine_0/S15_AXIS]
connect_bd_intf_net -intf_net S_AXI_FPD_0_1 [get_bd_intf_ports dma] [get_bd_intf_pins CIPS_0/S_AXI_FPD]
connect_bd_intf_net [get_bd_intf_pins aggr_noc/M00_INI] [get_bd_intf_pins noc_lpddr0/S04_INI]
connect_bd_intf_net [get_bd_intf_pins aggr_noc/M01_INI] [get_bd_intf_pins noc_lpddr1/S01_INI]
connect_bd_intf_net [get_bd_intf_pins aggr_noc/M02_INI] [get_bd_intf_pins noc_lpddr2/S01_INI]
connect_bd_intf_net [get_bd_intf_ports M00_AXIS_0] [get_bd_intf_pins ai_engine_0/M00_AXIS]
connect_bd_intf_net [get_bd_intf_ports M01_AXIS_0] [get_bd_intf_pins ai_engine_0/M01_AXIS]
connect_bd_intf_net [get_bd_intf_ports M02_AXIS_0] [get_bd_intf_pins ai_engine_0/M02_AXIS]
connect_bd_intf_net [get_bd_intf_ports M03_AXIS_0] [get_bd_intf_pins ai_engine_0/M03_AXIS]
connect_bd_intf_net [get_bd_intf_ports M04_AXIS_0] [get_bd_intf_pins ai_engine_0/M04_AXIS]
connect_bd_intf_net [get_bd_intf_ports M05_AXIS_0] [get_bd_intf_pins ai_engine_0/M05_AXIS]
connect_bd_intf_net [get_bd_intf_ports M06_AXIS_0] [get_bd_intf_pins ai_engine_0/M06_AXIS]
connect_bd_intf_net [get_bd_intf_ports M07_AXIS_0] [get_bd_intf_pins ai_engine_0/M07_AXIS]
connect_bd_intf_net [get_bd_intf_ports M08_AXIS_0] [get_bd_intf_pins ai_engine_0/M08_AXIS]
connect_bd_intf_net [get_bd_intf_ports M09_AXIS_0] [get_bd_intf_pins ai_engine_0/M09_AXIS]
connect_bd_intf_net [get_bd_intf_ports M10_AXIS_0] [get_bd_intf_pins ai_engine_0/M10_AXIS]
connect_bd_intf_net [get_bd_intf_ports M11_AXIS_0] [get_bd_intf_pins ai_engine_0/M11_AXIS]
connect_bd_intf_net [get_bd_intf_ports M12_AXIS_0] [get_bd_intf_pins ai_engine_0/M12_AXIS]
connect_bd_intf_net [get_bd_intf_ports M13_AXIS_0] [get_bd_intf_pins ai_engine_0/M13_AXIS]
connect_bd_intf_net [get_bd_intf_ports M14_AXIS_0] [get_bd_intf_pins ai_engine_0/M14_AXIS]
connect_bd_intf_net [get_bd_intf_ports M15_AXIS_0] [get_bd_intf_pins ai_engine_0/M15_AXIS]
connect_bd_intf_net -intf_net lpddr4_clk1_1 [get_bd_intf_ports lpddr4_clk1] [get_bd_intf_pins noc_lpddr0/sys_clk0]
connect_bd_intf_net -intf_net lpddr4_clk2_1 [get_bd_intf_ports lpddr4_clk2] [get_bd_intf_pins noc_lpddr1/sys_clk0]
connect_bd_intf_net -intf_net lpddr4_clk3_1 [get_bd_intf_ports lpddr4_clk3] [get_bd_intf_pins noc_lpddr2/sys_clk0]
connect_bd_intf_net [get_bd_intf_ports ch0_lpddr4_trip1] [get_bd_intf_pins noc_lpddr0/CH0_LPDDR4_0]
connect_bd_intf_net [get_bd_intf_ports ch1_lpddr4_trip1] [get_bd_intf_pins noc_lpddr0/CH1_LPDDR4_0]
connect_bd_intf_net [get_bd_intf_ports ch0_lpddr4_trip2] [get_bd_intf_pins noc_lpddr1/CH0_LPDDR4_0]
connect_bd_intf_net [get_bd_intf_ports ch1_lpddr4_trip2] [get_bd_intf_pins noc_lpddr1/CH1_LPDDR4_0]
connect_bd_intf_net [get_bd_intf_ports ch0_lpddr4_trip3] [get_bd_intf_pins noc_lpddr2/CH0_LPDDR4_0]
connect_bd_intf_net [get_bd_intf_ports ch1_lpddr4_trip3] [get_bd_intf_pins noc_lpddr2/CH1_LPDDR4_0]
connect_bd_net [get_bd_pins CIPS_0/fpd_axi_noc_axi0_clk] [get_bd_pins Master_NoC/aclk4]
connect_bd_net [get_bd_pins CIPS_0/fpd_axi_noc_axi1_clk] [get_bd_pins Master_NoC/aclk5]
connect_bd_net [get_bd_pins CIPS_0/fpd_cci_noc_axi0_clk] [get_bd_pins Master_NoC/aclk0]
connect_bd_net [get_bd_pins CIPS_0/fpd_cci_noc_axi1_clk] [get_bd_pins Master_NoC/aclk1]
connect_bd_net [get_bd_pins CIPS_0/fpd_cci_noc_axi2_clk] [get_bd_pins Master_NoC/aclk2]
connect_bd_net [get_bd_pins CIPS_0/fpd_cci_noc_axi3_clk] [get_bd_pins Master_NoC/aclk3]
connect_bd_net [get_bd_pins CIPS_0/lpd_axi_noc_clk] [get_bd_pins Master_NoC/aclk6]
connect_bd_net [get_bd_pins CIPS_0/pl0_ref_clk] [get_bd_ports plClk]
connect_bd_net [get_bd_pins CIPS_0/pl0_resetn] [get_bd_ports plRstL]
connect_bd_net [get_bd_pins CIPS_0/pmc_axi_noc_axi0_clk] [get_bd_pins Master_NoC/aclk7]
connect_bd_net -net aclk0_0_1 [get_bd_ports aieClk] [get_bd_pins ai_engine_0/aclk0]
connect_bd_net [get_bd_pins ai_engine_0/s00_axi_aclk] [get_bd_pins ConfigNoc/aclk0]
connect_bd_net -net m_axi_fpd_aclk_0_1 [get_bd_ports dmaClk] \
  [get_bd_pins CIPS_0/m_axi_fpd_aclk] [get_bd_pins CIPS_0/m_axi_lpd_aclk] [get_bd_pins CIPS_0/s_axi_fpd_aclk]
connect_bd_net -net pl_ps_irq0_0_1 [get_bd_ports dmaIrq] [get_bd_pins CIPS_0/pl_ps_irq0]

# ---- address map ----
assign_bd_address -offset 0x0000000000000000 -range 2G -target_address_space [get_bd_addr_spaces CIPS_0/FPD_AXI_NOC_0] [get_bd_addr_segs noc_lpddr0/S00_INI/C0_DDR_LOW0]
assign_bd_address -offset 0x0000000800000000 -range 2G -target_address_space [get_bd_addr_spaces CIPS_0/FPD_AXI_NOC_0] [get_bd_addr_segs noc_lpddr0/S00_INI/C0_DDR_LOW1]
assign_bd_address -offset 0x0000020000000000 -range 4G -target_address_space [get_bd_addr_spaces CIPS_0/FPD_AXI_NOC_0] [get_bd_addr_segs ai_engine_0/S00_AXI/AIE_ARRAY_0]
assign_bd_address -offset 0x0000050000000000 -range 4G -target_address_space [get_bd_addr_spaces CIPS_0/FPD_AXI_NOC_0] [get_bd_addr_segs noc_lpddr1/S00_INI/C1_DDR_CH1]
assign_bd_address -offset 0x0000060000000000 -range 4G -target_address_space [get_bd_addr_spaces CIPS_0/FPD_AXI_NOC_0] [get_bd_addr_segs noc_lpddr2/S00_INI/C1_DDR_CH2]
assign_bd_address -offset 0x0000000000000000 -range 2G -target_address_space [get_bd_addr_spaces CIPS_0/FPD_AXI_NOC_1] [get_bd_addr_segs noc_lpddr0/S00_INI/C0_DDR_LOW0]
assign_bd_address -offset 0x0000000800000000 -range 2G -target_address_space [get_bd_addr_spaces CIPS_0/FPD_AXI_NOC_1] [get_bd_addr_segs noc_lpddr0/S00_INI/C0_DDR_LOW1]
assign_bd_address -offset 0x0000020000000000 -range 4G -target_address_space [get_bd_addr_spaces CIPS_0/FPD_AXI_NOC_1] [get_bd_addr_segs ai_engine_0/S00_AXI/AIE_ARRAY_0]
assign_bd_address -offset 0x0000050000000000 -range 4G -target_address_space [get_bd_addr_spaces CIPS_0/FPD_AXI_NOC_1] [get_bd_addr_segs noc_lpddr1/S00_INI/C1_DDR_CH1]
assign_bd_address -offset 0x0000060000000000 -range 4G -target_address_space [get_bd_addr_spaces CIPS_0/FPD_AXI_NOC_1] [get_bd_addr_segs noc_lpddr2/S00_INI/C1_DDR_CH2]
assign_bd_address -offset 0x0000000000000000 -range 2G -target_address_space [get_bd_addr_spaces CIPS_0/FPD_CCI_NOC_0] [get_bd_addr_segs noc_lpddr0/S00_INI/C0_DDR_LOW0]
assign_bd_address -offset 0x0000000800000000 -range 2G -target_address_space [get_bd_addr_spaces CIPS_0/FPD_CCI_NOC_0] [get_bd_addr_segs noc_lpddr0/S00_INI/C0_DDR_LOW1]
assign_bd_address -offset 0x0000020000000000 -range 4G -target_address_space [get_bd_addr_spaces CIPS_0/FPD_CCI_NOC_0] [get_bd_addr_segs ai_engine_0/S00_AXI/AIE_ARRAY_0]
assign_bd_address -offset 0x0000050000000000 -range 4G -target_address_space [get_bd_addr_spaces CIPS_0/FPD_CCI_NOC_0] [get_bd_addr_segs noc_lpddr1/S00_INI/C1_DDR_CH1]
assign_bd_address -offset 0x0000060000000000 -range 4G -target_address_space [get_bd_addr_spaces CIPS_0/FPD_CCI_NOC_0] [get_bd_addr_segs noc_lpddr2/S00_INI/C1_DDR_CH2]
assign_bd_address -offset 0x0000000000000000 -range 2G -target_address_space [get_bd_addr_spaces CIPS_0/FPD_CCI_NOC_1] [get_bd_addr_segs noc_lpddr0/S01_INI/C1_DDR_LOW0]
assign_bd_address -offset 0x0000000800000000 -range 2G -target_address_space [get_bd_addr_spaces CIPS_0/FPD_CCI_NOC_1] [get_bd_addr_segs noc_lpddr0/S01_INI/C1_DDR_LOW1]
assign_bd_address -offset 0x0000020000000000 -range 4G -target_address_space [get_bd_addr_spaces CIPS_0/FPD_CCI_NOC_1] [get_bd_addr_segs ai_engine_0/S00_AXI/AIE_ARRAY_0]
assign_bd_address -offset 0x0000050000000000 -range 4G -target_address_space [get_bd_addr_spaces CIPS_0/FPD_CCI_NOC_1] [get_bd_addr_segs noc_lpddr1/S00_INI/C1_DDR_CH1]
assign_bd_address -offset 0x0000060000000000 -range 4G -target_address_space [get_bd_addr_spaces CIPS_0/FPD_CCI_NOC_1] [get_bd_addr_segs noc_lpddr2/S00_INI/C1_DDR_CH2]
assign_bd_address -offset 0x0000000000000000 -range 2G -target_address_space [get_bd_addr_spaces CIPS_0/FPD_CCI_NOC_2] [get_bd_addr_segs noc_lpddr0/S02_INI/C2_DDR_LOW0]
assign_bd_address -offset 0x0000000800000000 -range 2G -target_address_space [get_bd_addr_spaces CIPS_0/FPD_CCI_NOC_2] [get_bd_addr_segs noc_lpddr0/S02_INI/C2_DDR_LOW1]
assign_bd_address -offset 0x0000020000000000 -range 4G -target_address_space [get_bd_addr_spaces CIPS_0/FPD_CCI_NOC_2] [get_bd_addr_segs ai_engine_0/S00_AXI/AIE_ARRAY_0]
assign_bd_address -offset 0x0000050000000000 -range 4G -target_address_space [get_bd_addr_spaces CIPS_0/FPD_CCI_NOC_2] [get_bd_addr_segs noc_lpddr1/S00_INI/C1_DDR_CH1]
assign_bd_address -offset 0x0000060000000000 -range 4G -target_address_space [get_bd_addr_spaces CIPS_0/FPD_CCI_NOC_2] [get_bd_addr_segs noc_lpddr2/S00_INI/C1_DDR_CH2]
assign_bd_address -offset 0x0000000000000000 -range 2G -target_address_space [get_bd_addr_spaces CIPS_0/FPD_CCI_NOC_3] [get_bd_addr_segs noc_lpddr0/S03_INI/C3_DDR_LOW0]
assign_bd_address -offset 0x0000000800000000 -range 2G -target_address_space [get_bd_addr_spaces CIPS_0/FPD_CCI_NOC_3] [get_bd_addr_segs noc_lpddr0/S03_INI/C3_DDR_LOW1]
assign_bd_address -offset 0x0000020000000000 -range 4G -target_address_space [get_bd_addr_spaces CIPS_0/FPD_CCI_NOC_3] [get_bd_addr_segs ai_engine_0/S00_AXI/AIE_ARRAY_0]
assign_bd_address -offset 0x0000050000000000 -range 4G -target_address_space [get_bd_addr_spaces CIPS_0/FPD_CCI_NOC_3] [get_bd_addr_segs noc_lpddr1/S00_INI/C1_DDR_CH1]
assign_bd_address -offset 0x0000060000000000 -range 4G -target_address_space [get_bd_addr_spaces CIPS_0/FPD_CCI_NOC_3] [get_bd_addr_segs noc_lpddr2/S00_INI/C1_DDR_CH2]
assign_bd_address -offset 0x0000000000000000 -range 2G -target_address_space [get_bd_addr_spaces CIPS_0/LPD_AXI_NOC_0] [get_bd_addr_segs noc_lpddr0/S00_INI/C0_DDR_LOW0]
assign_bd_address -offset 0x0000000800000000 -range 2G -target_address_space [get_bd_addr_spaces CIPS_0/LPD_AXI_NOC_0] [get_bd_addr_segs noc_lpddr0/S00_INI/C0_DDR_LOW1]
assign_bd_address -offset 0x00400000000 -range 4G -target_address_space [get_bd_addr_spaces CIPS_0/M_AXI_FPD] [get_bd_addr_segs axiLite/Reg]
assign_bd_address -offset 0x00080000000 -range 64K -target_address_space [get_bd_addr_spaces CIPS_0/M_AXI_LPD] [get_bd_addr_segs dmaCtrl/Reg]
assign_bd_address -offset 0x0000000000000000 -range 2G -target_address_space [get_bd_addr_spaces CIPS_0/PMC_NOC_AXI_0] [get_bd_addr_segs noc_lpddr0/S00_INI/C0_DDR_LOW0]
assign_bd_address -offset 0x0000000800000000 -range 2G -target_address_space [get_bd_addr_spaces CIPS_0/PMC_NOC_AXI_0] [get_bd_addr_segs noc_lpddr0/S00_INI/C0_DDR_LOW1]
assign_bd_address -offset 0x0000020000000000 -range 4G -target_address_space [get_bd_addr_spaces CIPS_0/PMC_NOC_AXI_0] [get_bd_addr_segs ai_engine_0/S00_AXI/AIE_ARRAY_0]
assign_bd_address -offset 0x0000050000000000 -range 4G -target_address_space [get_bd_addr_spaces CIPS_0/PMC_NOC_AXI_0] [get_bd_addr_segs noc_lpddr1/S00_INI/C1_DDR_CH1]
assign_bd_address -offset 0x0000060000000000 -range 4G -target_address_space [get_bd_addr_spaces CIPS_0/PMC_NOC_AXI_0] [get_bd_addr_segs noc_lpddr2/S00_INI/C1_DDR_CH2]
assign_bd_address -offset 0x00000C0000000 -range 512M -target_address_space [get_bd_addr_spaces dma] [get_bd_addr_segs CIPS_0/S_AXI_FPD/pspmc_0_psv_pmc_qspi_ospi_flash_0]
assign_bd_address -offset 0x00000F0310000 -range 32K -target_address_space [get_bd_addr_spaces dma] [get_bd_addr_segs CIPS_0/S_AXI_FPD/pspmc_0_psv_pmc_ppu1_mdm_0]
assign_bd_address -offset 0x00000F0800000 -range 64K -target_address_space [get_bd_addr_spaces dma] [get_bd_addr_segs CIPS_0/S_AXI_FPD/pspmc_0_psv_coresight_0]
assign_bd_address -offset 0x00000F08D0000 -range 64K -target_address_space [get_bd_addr_spaces dma] [get_bd_addr_segs CIPS_0/S_AXI_FPD/pspmc_0_psv_coresight_pmc_cti]
assign_bd_address -offset 0x00000F0980000 -range 64K -target_address_space [get_bd_addr_spaces dma] [get_bd_addr_segs CIPS_0/S_AXI_FPD/pspmc_0_psv_coresight_lpd_atm]
assign_bd_address -offset 0x00000F09D0000 -range 64K -target_address_space [get_bd_addr_spaces dma] [get_bd_addr_segs CIPS_0/S_AXI_FPD/pspmc_0_psv_coresight_lpd_cti]
assign_bd_address -offset 0x00000F0A10000 -range 64K -target_address_space [get_bd_addr_spaces dma] [get_bd_addr_segs CIPS_0/S_AXI_FPD/pspmc_0_psv_coresight_r50_cti]
assign_bd_address -offset 0x00000F0A50000 -range 64K -target_address_space [get_bd_addr_spaces dma] [get_bd_addr_segs CIPS_0/S_AXI_FPD/pspmc_0_psv_coresight_r51_cti]
assign_bd_address -offset 0x00000F0B70000 -range 64K -target_address_space [get_bd_addr_spaces dma] [get_bd_addr_segs CIPS_0/S_AXI_FPD/pspmc_0_psv_coresight_fpd_stm]
assign_bd_address -offset 0x00000F0B80000 -range 64K -target_address_space [get_bd_addr_spaces dma] [get_bd_addr_segs CIPS_0/S_AXI_FPD/pspmc_0_psv_coresight_fpd_atm]
assign_bd_address -offset 0x00000F0BB0000 -range 64K -target_address_space [get_bd_addr_spaces dma] [get_bd_addr_segs CIPS_0/S_AXI_FPD/pspmc_0_psv_coresight_fpd_cti1b]
assign_bd_address -offset 0x00000F0BC0000 -range 64K -target_address_space [get_bd_addr_spaces dma] [get_bd_addr_segs CIPS_0/S_AXI_FPD/pspmc_0_psv_coresight_fpd_cti1c]
assign_bd_address -offset 0x00000F0BD0000 -range 64K -target_address_space [get_bd_addr_spaces dma] [get_bd_addr_segs CIPS_0/S_AXI_FPD/pspmc_0_psv_coresight_fpd_cti1d]
assign_bd_address -offset 0x00000F0C20000 -range 64K -target_address_space [get_bd_addr_spaces dma] [get_bd_addr_segs CIPS_0/S_AXI_FPD/pspmc_0_psv_coresight_apu_fun]
assign_bd_address -offset 0x00000F0C30000 -range 64K -target_address_space [get_bd_addr_spaces dma] [get_bd_addr_segs CIPS_0/S_AXI_FPD/pspmc_0_psv_coresight_apu_etf]
assign_bd_address -offset 0x00000F0C60000 -range 64K -target_address_space [get_bd_addr_spaces dma] [get_bd_addr_segs CIPS_0/S_AXI_FPD/pspmc_0_psv_coresight_apu_ela]
assign_bd_address -offset 0x00000F0CA0000 -range 64K -target_address_space [get_bd_addr_spaces dma] [get_bd_addr_segs CIPS_0/S_AXI_FPD/pspmc_0_psv_coresight_apu_cti]
assign_bd_address -offset 0x00000F0D00000 -range 64K -target_address_space [get_bd_addr_spaces dma] [get_bd_addr_segs CIPS_0/S_AXI_FPD/pspmc_0_psv_coresight_a720_dbg]
assign_bd_address -offset 0x00000F0D10000 -range 64K -target_address_space [get_bd_addr_spaces dma] [get_bd_addr_segs CIPS_0/S_AXI_FPD/pspmc_0_psv_coresight_a720_cti]
assign_bd_address -offset 0x00000F0D20000 -range 64K -target_address_space [get_bd_addr_spaces dma] [get_bd_addr_segs CIPS_0/S_AXI_FPD/pspmc_0_psv_coresight_a720_pmu]
assign_bd_address -offset 0x00000F0D30000 -range 64K -target_address_space [get_bd_addr_spaces dma] [get_bd_addr_segs CIPS_0/S_AXI_FPD/pspmc_0_psv_coresight_a720_etm]
assign_bd_address -offset 0x00000F0D40000 -range 64K -target_address_space [get_bd_addr_spaces dma] [get_bd_addr_segs CIPS_0/S_AXI_FPD/pspmc_0_psv_coresight_a721_dbg]
assign_bd_address -offset 0x00000F0D50000 -range 64K -target_address_space [get_bd_addr_spaces dma] [get_bd_addr_segs CIPS_0/S_AXI_FPD/pspmc_0_psv_coresight_a721_cti]
assign_bd_address -offset 0x00000F0D60000 -range 64K -target_address_space [get_bd_addr_spaces dma] [get_bd_addr_segs CIPS_0/S_AXI_FPD/pspmc_0_psv_coresight_a721_pmu]
assign_bd_address -offset 0x00000F0D70000 -range 64K -target_address_space [get_bd_addr_spaces dma] [get_bd_addr_segs CIPS_0/S_AXI_FPD/pspmc_0_psv_coresight_a721_etm]
assign_bd_address -offset 0x00000F0F00000 -range 64K -target_address_space [get_bd_addr_spaces dma] [get_bd_addr_segs CIPS_0/S_AXI_FPD/pspmc_0_psv_coresight_cpm_rom]
assign_bd_address -offset 0x00000F0F20000 -range 64K -target_address_space [get_bd_addr_spaces dma] [get_bd_addr_segs CIPS_0/S_AXI_FPD/pspmc_0_psv_coresight_cpm_fun]
assign_bd_address -offset 0x00000F0F40000 -range 64K -target_address_space [get_bd_addr_spaces dma] [get_bd_addr_segs CIPS_0/S_AXI_FPD/pspmc_0_psv_coresight_cpm_ela2a]
assign_bd_address -offset 0x00000F0F50000 -range 64K -target_address_space [get_bd_addr_spaces dma] [get_bd_addr_segs CIPS_0/S_AXI_FPD/pspmc_0_psv_coresight_cpm_ela2b]
assign_bd_address -offset 0x00000F0F60000 -range 64K -target_address_space [get_bd_addr_spaces dma] [get_bd_addr_segs CIPS_0/S_AXI_FPD/pspmc_0_psv_coresight_cpm_ela2c]
assign_bd_address -offset 0x00000F0F70000 -range 64K -target_address_space [get_bd_addr_spaces dma] [get_bd_addr_segs CIPS_0/S_AXI_FPD/pspmc_0_psv_coresight_cpm_ela2d]
assign_bd_address -offset 0x00000F0F80000 -range 64K -target_address_space [get_bd_addr_spaces dma] [get_bd_addr_segs CIPS_0/S_AXI_FPD/pspmc_0_psv_coresight_cpm_atm]
assign_bd_address -offset 0x00000F0FA0000 -range 64K -target_address_space [get_bd_addr_spaces dma] [get_bd_addr_segs CIPS_0/S_AXI_FPD/pspmc_0_psv_coresight_cpm_cti2a]
assign_bd_address -offset 0x00000F0FD0000 -range 64K -target_address_space [get_bd_addr_spaces dma] [get_bd_addr_segs CIPS_0/S_AXI_FPD/pspmc_0_psv_coresight_cpm_cti2d]
assign_bd_address -offset 0x00000F1010000 -range 64K -target_address_space [get_bd_addr_spaces dma] [get_bd_addr_segs CIPS_0/S_AXI_FPD/pspmc_0_psv_pmc_ospi_0]
assign_bd_address -offset 0x00000F1020000 -range 64K -target_address_space [get_bd_addr_spaces dma] [get_bd_addr_segs CIPS_0/S_AXI_FPD/pspmc_0_psv_pmc_gpio_0]
assign_bd_address -offset 0x00000F1050000 -range 64K -target_address_space [get_bd_addr_spaces dma] [get_bd_addr_segs CIPS_0/S_AXI_FPD/pspmc_0_psv_pmc_sd_1]
assign_bd_address -offset 0x00000F1110000 -range 320K -target_address_space [get_bd_addr_spaces dma] [get_bd_addr_segs CIPS_0/S_AXI_FPD/pspmc_0_psv_pmc_global_0]
assign_bd_address -offset 0x00000F11C0000 -range 64K -target_address_space [get_bd_addr_spaces dma] [get_bd_addr_segs CIPS_0/S_AXI_FPD/pspmc_0_psv_pmc_dma_0]
assign_bd_address -offset 0x00000F11D0000 -range 64K -target_address_space [get_bd_addr_spaces dma] [get_bd_addr_segs CIPS_0/S_AXI_FPD/pspmc_0_psv_pmc_dma_1]
assign_bd_address -offset 0x00000F11E0000 -range 64K -target_address_space [get_bd_addr_spaces dma] [get_bd_addr_segs CIPS_0/S_AXI_FPD/pspmc_0_psv_pmc_aes]
assign_bd_address -offset 0x00000F11F0000 -range 64K -target_address_space [get_bd_addr_spaces dma] [get_bd_addr_segs CIPS_0/S_AXI_FPD/pspmc_0_psv_pmc_bbram_ctrl]
assign_bd_address -offset 0x00000F1200000 -range 64K -target_address_space [get_bd_addr_spaces dma] [get_bd_addr_segs CIPS_0/S_AXI_FPD/pspmc_0_psv_pmc_rsa]
assign_bd_address -offset 0x00000F1210000 -range 64K -target_address_space [get_bd_addr_spaces dma] [get_bd_addr_segs CIPS_0/S_AXI_FPD/pspmc_0_psv_pmc_sha]
assign_bd_address -offset 0x00000F1220000 -range 64K -target_address_space [get_bd_addr_spaces dma] [get_bd_addr_segs CIPS_0/S_AXI_FPD/pspmc_0_psv_pmc_slave_boot]
assign_bd_address -offset 0x00000F1230000 -range 64K -target_address_space [get_bd_addr_spaces dma] [get_bd_addr_segs CIPS_0/S_AXI_FPD/pspmc_0_psv_pmc_trng]
assign_bd_address -offset 0x00000F1240000 -range 64K -target_address_space [get_bd_addr_spaces dma] [get_bd_addr_segs CIPS_0/S_AXI_FPD/pspmc_0_psv_pmc_efuse_ctrl]
assign_bd_address -offset 0x00000F1250000 -range 64K -target_address_space [get_bd_addr_spaces dma] [get_bd_addr_segs CIPS_0/S_AXI_FPD/pspmc_0_psv_pmc_efuse_cache]
assign_bd_address -offset 0x00000F1260000 -range 64K -target_address_space [get_bd_addr_spaces dma] [get_bd_addr_segs CIPS_0/S_AXI_FPD/pspmc_0_psv_crp_0]
assign_bd_address -offset 0x00000F1270000 -range 192K -target_address_space [get_bd_addr_spaces dma] [get_bd_addr_segs CIPS_0/S_AXI_FPD/pspmc_0_psv_pmc_sysmon_0]
assign_bd_address -offset 0x00000F12A0000 -range 64K -target_address_space [get_bd_addr_spaces dma] [get_bd_addr_segs CIPS_0/S_AXI_FPD/pspmc_0_psv_pmc_rtc_0]
assign_bd_address -offset 0x00000F12B0000 -range 64K -target_address_space [get_bd_addr_spaces dma] [get_bd_addr_segs CIPS_0/S_AXI_FPD/pspmc_0_psv_pmc_cfu_apb_0]
assign_bd_address -offset 0x00000F12D0000 -range 4K -target_address_space [get_bd_addr_spaces dma] [get_bd_addr_segs CIPS_0/S_AXI_FPD/pspmc_0_psv_pmc_cfi_cframe_0]
assign_bd_address -offset 0x00000F12F0000 -range 64K -target_address_space [get_bd_addr_spaces dma] [get_bd_addr_segs CIPS_0/S_AXI_FPD/pspmc_0_psv_pmc_xmpu_0]
assign_bd_address -offset 0x00000F1300000 -range 64K -target_address_space [get_bd_addr_spaces dma] [get_bd_addr_segs CIPS_0/S_AXI_FPD/pspmc_0_psv_pmc_xppu_npi_0]
assign_bd_address -offset 0x00000F1310000 -range 64K -target_address_space [get_bd_addr_spaces dma] [get_bd_addr_segs CIPS_0/S_AXI_FPD/pspmc_0_psv_pmc_xppu_0]
assign_bd_address -offset 0x00000F2000000 -range 128K -target_address_space [get_bd_addr_spaces dma] [get_bd_addr_segs CIPS_0/S_AXI_FPD/pspmc_0_psv_pmc_ram]
assign_bd_address -offset 0x00000F2100000 -range 64K -target_address_space [get_bd_addr_spaces dma] [get_bd_addr_segs CIPS_0/S_AXI_FPD/pspmc_0_psv_pmc_slave_boot_stream]
assign_bd_address -offset 0x00000F6000000 -range 32M -target_address_space [get_bd_addr_spaces dma] [get_bd_addr_segs CIPS_0/S_AXI_FPD/pspmc_0_psv_pmc_ram_npi]
assign_bd_address -offset 0x00000FD000000 -range 1M -target_address_space [get_bd_addr_spaces dma] [get_bd_addr_segs CIPS_0/S_AXI_FPD/pspmc_0_psv_fpd_maincci_0]
assign_bd_address -offset 0x00000FD1A0000 -range 1280K -target_address_space [get_bd_addr_spaces dma] [get_bd_addr_segs CIPS_0/S_AXI_FPD/pspmc_0_psv_crf_0]
assign_bd_address -offset 0x00000FD360000 -range 64K -target_address_space [get_bd_addr_spaces dma] [get_bd_addr_segs CIPS_0/S_AXI_FPD/pspmc_0_psv_fpd_afi_0]
assign_bd_address -offset 0x00000FD380000 -range 64K -target_address_space [get_bd_addr_spaces dma] [get_bd_addr_segs CIPS_0/S_AXI_FPD/pspmc_0_psv_fpd_afi_2]
assign_bd_address -offset 0x00000FD390000 -range 64K -target_address_space [get_bd_addr_spaces dma] [get_bd_addr_segs CIPS_0/S_AXI_FPD/pspmc_0_psv_fpd_slave_xmpu_0]
assign_bd_address -offset 0x00000FD5C0000 -range 64K -target_address_space [get_bd_addr_spaces dma] [get_bd_addr_segs CIPS_0/S_AXI_FPD/pspmc_0_psv_apu_0]
assign_bd_address -offset 0x00000FD5E0000 -range 64K -target_address_space [get_bd_addr_spaces dma] [get_bd_addr_segs CIPS_0/S_AXI_FPD/pspmc_0_psv_fpd_cci_0]
assign_bd_address -offset 0x00000FD5F0000 -range 64K -target_address_space [get_bd_addr_spaces dma] [get_bd_addr_segs CIPS_0/S_AXI_FPD/pspmc_0_psv_fpd_smmu_0]
assign_bd_address -offset 0x00000FD610000 -range 64K -target_address_space [get_bd_addr_spaces dma] [get_bd_addr_segs CIPS_0/S_AXI_FPD/pspmc_0_psv_fpd_slcr_0]
assign_bd_address -offset 0x00000FD690000 -range 64K -target_address_space [get_bd_addr_spaces dma] [get_bd_addr_segs CIPS_0/S_AXI_FPD/pspmc_0_psv_fpd_slcr_secure_0]
assign_bd_address -offset 0x00000FD700000 -range 1M -target_address_space [get_bd_addr_spaces dma] [get_bd_addr_segs CIPS_0/S_AXI_FPD/pspmc_0_psv_fpd_gpv_0]
assign_bd_address -offset 0x00000FD800000 -range 8M -target_address_space [get_bd_addr_spaces dma] [get_bd_addr_segs CIPS_0/S_AXI_FPD/pspmc_0_psv_fpd_smmutcu_0]
assign_bd_address -offset 0x00000FE200000 -range 1M -target_address_space [get_bd_addr_spaces dma] [get_bd_addr_segs CIPS_0/S_AXI_FPD/pspmc_0_psv_usb_xhci_0]
assign_bd_address -offset 0x00000FF000000 -range 64K -target_address_space [get_bd_addr_spaces dma] [get_bd_addr_segs CIPS_0/S_AXI_FPD/pspmc_0_psv_sbsauart_0]
assign_bd_address -offset 0x00000FF020000 -range 64K -target_address_space [get_bd_addr_spaces dma] [get_bd_addr_segs CIPS_0/S_AXI_FPD/pspmc_0_psv_i2c_0]
assign_bd_address -offset 0x00000FF030000 -range 64K -target_address_space [get_bd_addr_spaces dma] [get_bd_addr_segs CIPS_0/S_AXI_FPD/pspmc_0_psv_i2c_1]
assign_bd_address -offset 0x00000FF060000 -range 64K -target_address_space [get_bd_addr_spaces dma] [get_bd_addr_segs CIPS_0/S_AXI_FPD/pspmc_0_psv_canfd_0]
assign_bd_address -offset 0x00000FF070000 -range 64K -target_address_space [get_bd_addr_spaces dma] [get_bd_addr_segs CIPS_0/S_AXI_FPD/pspmc_0_psv_canfd_1]
assign_bd_address -offset 0x00000FF080000 -range 128K -target_address_space [get_bd_addr_spaces dma] [get_bd_addr_segs CIPS_0/S_AXI_FPD/pspmc_0_psv_lpd_iou_slcr_0]
assign_bd_address -offset 0x00000FF0A0000 -range 64K -target_address_space [get_bd_addr_spaces dma] [get_bd_addr_segs CIPS_0/S_AXI_FPD/pspmc_0_psv_lpd_iou_secure_slcr_0]
assign_bd_address -offset 0x00000FF0C0000 -range 64K -target_address_space [get_bd_addr_spaces dma] [get_bd_addr_segs CIPS_0/S_AXI_FPD/pspmc_0_psv_ethernet_0]
assign_bd_address -offset 0x00000FF0E0000 -range 64K -target_address_space [get_bd_addr_spaces dma] [get_bd_addr_segs CIPS_0/S_AXI_FPD/pspmc_0_psv_ttc_0]
assign_bd_address -offset 0x00000FF130000 -range 64K -target_address_space [get_bd_addr_spaces dma] [get_bd_addr_segs CIPS_0/S_AXI_FPD/pspmc_0_psv_scntr_0]
assign_bd_address -offset 0x00000FF140000 -range 64K -target_address_space [get_bd_addr_spaces dma] [get_bd_addr_segs CIPS_0/S_AXI_FPD/pspmc_0_psv_scntrs_0]
assign_bd_address -offset 0x00000FF310000 -range 64K -target_address_space [get_bd_addr_spaces dma] [get_bd_addr_segs CIPS_0/S_AXI_FPD/pspmc_0_psv_ipi_psm]
assign_bd_address -offset 0x00000FF320000 -range 64K -target_address_space [get_bd_addr_spaces dma] [get_bd_addr_segs CIPS_0/S_AXI_FPD/pspmc_0_psv_ipi_pmc]
assign_bd_address -offset 0x00000FF330000 -range 64K -target_address_space [get_bd_addr_spaces dma] [get_bd_addr_segs CIPS_0/S_AXI_FPD/pspmc_0_psv_ipi_0]
assign_bd_address -offset 0x00000FF340000 -range 64K -target_address_space [get_bd_addr_spaces dma] [get_bd_addr_segs CIPS_0/S_AXI_FPD/pspmc_0_psv_ipi_1]
assign_bd_address -offset 0x00000FF350000 -range 64K -target_address_space [get_bd_addr_spaces dma] [get_bd_addr_segs CIPS_0/S_AXI_FPD/pspmc_0_psv_ipi_2]
assign_bd_address -offset 0x00000FF360000 -range 64K -target_address_space [get_bd_addr_spaces dma] [get_bd_addr_segs CIPS_0/S_AXI_FPD/pspmc_0_psv_ipi_3]
assign_bd_address -offset 0x00000FF370000 -range 64K -target_address_space [get_bd_addr_spaces dma] [get_bd_addr_segs CIPS_0/S_AXI_FPD/pspmc_0_psv_ipi_4]
assign_bd_address -offset 0x00000FF380000 -range 64K -target_address_space [get_bd_addr_spaces dma] [get_bd_addr_segs CIPS_0/S_AXI_FPD/pspmc_0_psv_ipi_5]
assign_bd_address -offset 0x00000FF390000 -range 64K -target_address_space [get_bd_addr_spaces dma] [get_bd_addr_segs CIPS_0/S_AXI_FPD/pspmc_0_psv_ipi_pmc_nobuf]
assign_bd_address -offset 0x00000FF3A0000 -range 64K -target_address_space [get_bd_addr_spaces dma] [get_bd_addr_segs CIPS_0/S_AXI_FPD/pspmc_0_psv_ipi_6]
assign_bd_address -offset 0x00000FF3F0000 -range 4K -target_address_space [get_bd_addr_spaces dma] [get_bd_addr_segs CIPS_0/S_AXI_FPD/pspmc_0_psv_ipi_buffer]
assign_bd_address -offset 0x00000FF410000 -range 1M -target_address_space [get_bd_addr_spaces dma] [get_bd_addr_segs CIPS_0/S_AXI_FPD/pspmc_0_psv_lpd_slcr_0]
assign_bd_address -offset 0x00000FF510000 -range 256K -target_address_space [get_bd_addr_spaces dma] [get_bd_addr_segs CIPS_0/S_AXI_FPD/pspmc_0_psv_lpd_slcr_secure_0]
assign_bd_address -offset 0x00000FF5E0000 -range 3M -target_address_space [get_bd_addr_spaces dma] [get_bd_addr_segs CIPS_0/S_AXI_FPD/pspmc_0_psv_crl_0]
assign_bd_address -offset 0x00000FF960000 -range 64K -target_address_space [get_bd_addr_spaces dma] [get_bd_addr_segs CIPS_0/S_AXI_FPD/pspmc_0_psv_ocm_ctrl]
assign_bd_address -offset 0x00000FF980000 -range 64K -target_address_space [get_bd_addr_spaces dma] [get_bd_addr_segs CIPS_0/S_AXI_FPD/pspmc_0_psv_ocm_xmpu_0]
assign_bd_address -offset 0x00000FF990000 -range 64K -target_address_space [get_bd_addr_spaces dma] [get_bd_addr_segs CIPS_0/S_AXI_FPD/pspmc_0_psv_lpd_xppu_0]
assign_bd_address -offset 0x00000FF9A0000 -range 64K -target_address_space [get_bd_addr_spaces dma] [get_bd_addr_segs CIPS_0/S_AXI_FPD/pspmc_0_psv_rpu_0]
assign_bd_address -offset 0x00000FF9B0000 -range 64K -target_address_space [get_bd_addr_spaces dma] [get_bd_addr_segs CIPS_0/S_AXI_FPD/pspmc_0_psv_lpd_afi_0]
assign_bd_address -offset 0x00000FF9D0000 -range 64K -target_address_space [get_bd_addr_spaces dma] [get_bd_addr_segs CIPS_0/S_AXI_FPD/pspmc_0_psv_usb_0]
assign_bd_address -offset 0x00000FFA80000 -range 64K -target_address_space [get_bd_addr_spaces dma] [get_bd_addr_segs CIPS_0/S_AXI_FPD/pspmc_0_psv_adma_0]
assign_bd_address -offset 0x00000FFA90000 -range 64K -target_address_space [get_bd_addr_spaces dma] [get_bd_addr_segs CIPS_0/S_AXI_FPD/pspmc_0_psv_adma_1]
assign_bd_address -offset 0x00000FFAA0000 -range 64K -target_address_space [get_bd_addr_spaces dma] [get_bd_addr_segs CIPS_0/S_AXI_FPD/pspmc_0_psv_adma_2]
assign_bd_address -offset 0x00000FFAB0000 -range 64K -target_address_space [get_bd_addr_spaces dma] [get_bd_addr_segs CIPS_0/S_AXI_FPD/pspmc_0_psv_adma_3]
assign_bd_address -offset 0x00000FFAC0000 -range 64K -target_address_space [get_bd_addr_spaces dma] [get_bd_addr_segs CIPS_0/S_AXI_FPD/pspmc_0_psv_adma_4]
assign_bd_address -offset 0x00000FFAD0000 -range 64K -target_address_space [get_bd_addr_spaces dma] [get_bd_addr_segs CIPS_0/S_AXI_FPD/pspmc_0_psv_adma_5]
